# Altium schematic sheet 13 CAN RS232 485.SchDoc
size A4
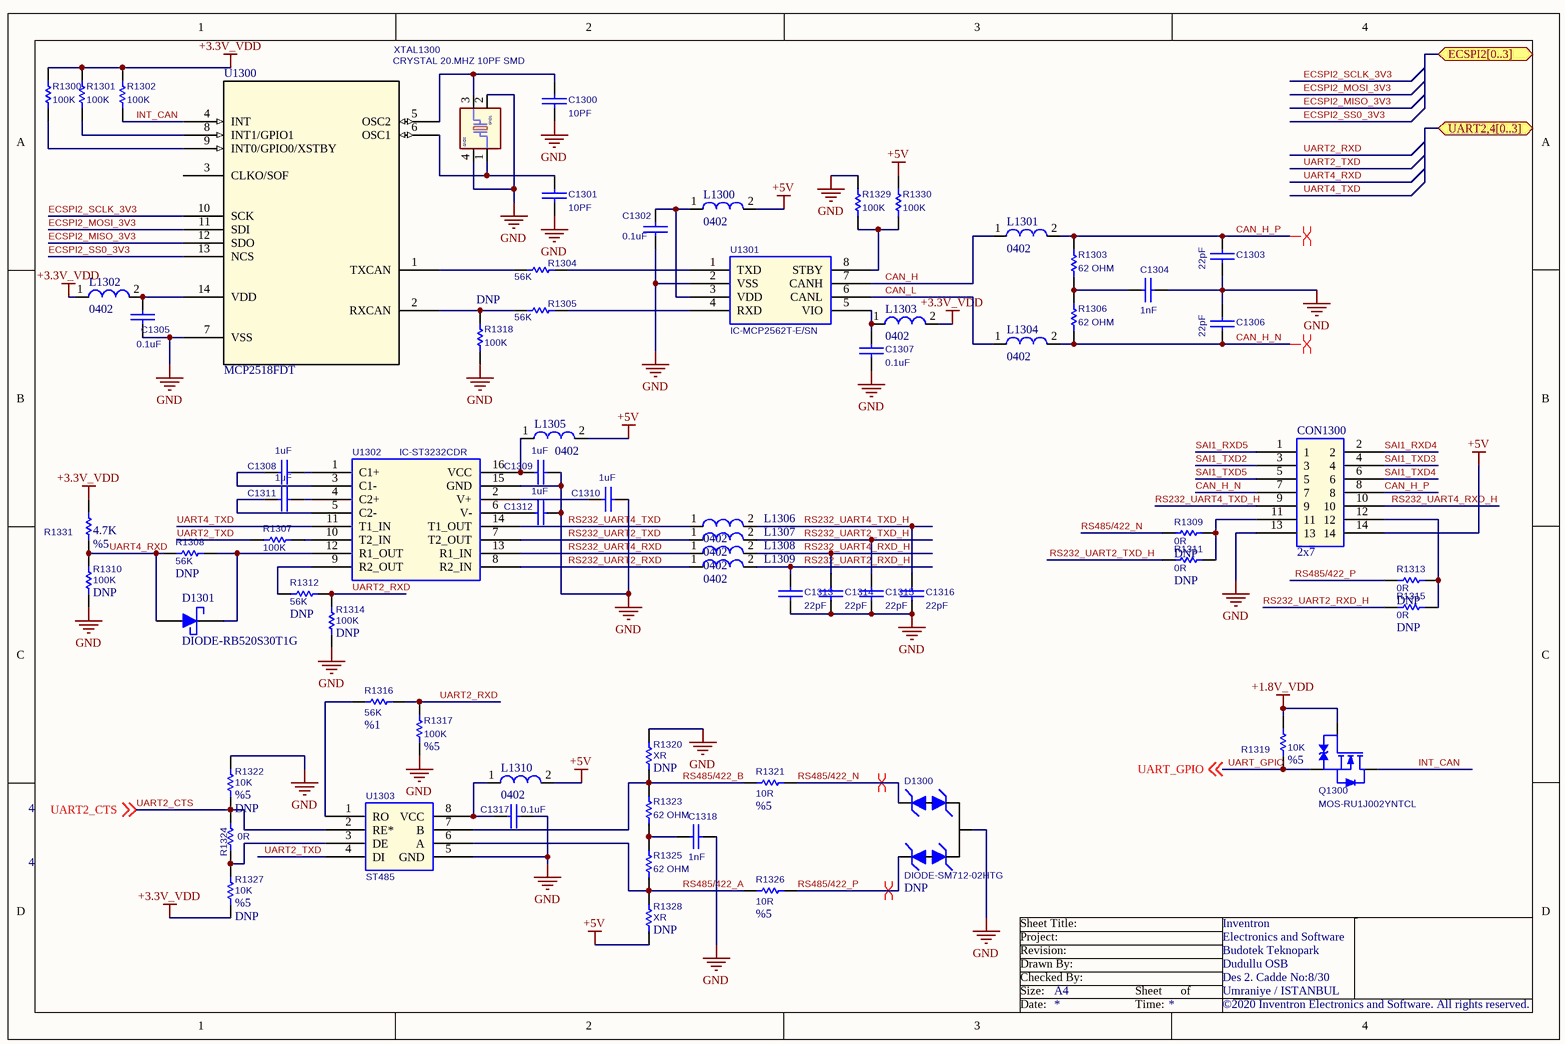
[diagram p0: 13 CAN RS232 485.SchDoc]

## Parts
C1300  10PF  [0402_CC]
C1301  10PF  [0402_CC]
C1302  0.1uF  [0402_CC]
C1303  22pF  [0402_CC]
C1304  1nF  [0603_CC]
C1305  0.1uF  [0402_CC]
C1306  22pF  [0402_CC]
C1307  0.1uF  [0402_CC]
C1308  1uF  [0603_CC]
C1309  1uF  [0603_CC]
C1310  1uF  [0603_CC]
C1311  1uF  [0603_CC]
C1312  1uF  [0603_CC]
C1313  22pF  [0402_CC]
C1314  22pF  [0402_CC]
C1315  22pF  [0402_CC]
C1316  22pF  [0402_CC]
C1317  0.1uF  [0402_CC]
C1318  1nF  [0603_CC]
CON1300  2x7  [HEADER 2.54 2X7]
D1300  DIODE-SM712-02HTG  ASSY_OPT: DNP  [SOT23]  (no BOM)
D1301  DIODE-RB520S30T1G  [SOD523]
L1300  0402  [0402_RES]
L1301  0402  [0402_RES]
L1302  0402  [0402_RES]
L1303  0402  [0402_RES]
L1304  0402  [0402_RES]
L1305  0402  [0402_RES]
L1306  0402  [0402_RES]
L1307  0402  [0402_RES]
L1308  0402  [0402_RES]
L1309  0402  [0402_RES]
L1310  0402  [0402_RES]
Q1300  MOS-RU1J002YNTCL  [SC-85-3/SOT-323FL]
R1300  100K  [0402_RES]
R1301  100K  [0402_RES]
R1302  100K  [0402_RES]
R1303  62 OHM  [1206]
R1304  56K  [0402_RES]
R1305  56K  [0402_RES]
R1306  62 OHM  [1206]
R1307  100K  [0402_RES]
R1308  56K  ASSY_OPT: DNP  [0402_RES]  (no BOM)
R1309  0R  ASSY_OPT: DNP  [0402_RES]  (no BOM)
R1310  100K  ASSY_OPT: DNP  [0402_RES]  (no BOM)
R1311  0R  ASSY_OPT: DNP  [0402_RES]  (no BOM)
R1312  56K  ASSY_OPT: DNP  [0402_RES]  (no BOM)
R1313  0R  ASSY_OPT: DNP  [0402_RES]  (no BOM)
R1314  100K  ASSY_OPT: DNP  [0402_RES]  (no BOM)
R1315  0R  ASSY_OPT: DNP  [0402_RES]  (no BOM)
R1316  56K  Tolerance: %1  [0402_RES]
R1317  100K  Tolerance: %5  [0402_RES]
R1318  100K  ASSY_OPT: DNP  [0402_RES]  (no BOM)
R1319  10K  Tolerance: %5  [0402_RES]
R1320  XR  ASSY_OPT: DNP  [0603_RES]  (no BOM)
R1321  10R  Tolerance: %5  [0402_RES]
R1322  10K  Tolerance: %5  ASSY_OPT: DNP  [0402_RES]  (no BOM)
R1323  62 OHM  [1206]
R1324  0R  [0402_RES]
R1325  62 OHM  [1206]
R1326  10R  Tolerance: %5  [0402_RES]
R1327  10K  Tolerance: %5  ASSY_OPT: DNP  [0402_RES]  (no BOM)
R1328  XR  ASSY_OPT: DNP  [0603_RES]  (no BOM)
R1329  100K  [0402_RES]
R1330  100K  [0402_RES]  (no BOM)
R1331  4.7K  Tolerance: %5  [0402_RES]
U1300  MCP2518FDT  [SOIC-14]
U1301  IC-MCP2562T-E/SN  [8-SOIC/FAN3229]
U1302  IC-ST3232CDR  [SO-16]
U1303  ST485  [8-SOIC/FAN3229]
XTAL1300  CRYSTAL 20.MHZ 10PF SMD  [XTLOSC4_3P2X2P5MM_SM]

## Ports
ECSPI2[0..3] (bidir), UART2,4[0..3] (bidir)

## Nets
+1.8V_VDD: Q1300.1(G) R1319.1
+3.3V_VDD: L1302.1 L1303.2 R1300.2 R1301.2 R1302.2 R1327.1 R1331.2
+5V: CON1300.14 L1300.2 L1305.2 L1310.2 R1328.1 R1330.2
GND: C1300.2 C1301.2 C1302.1 C1303.2 C1304.2 C1305.2 C1306.1 C1307.1 C1309.2 C1310.2 C1312.2 C1313.2 C1314.2 C1315.2 C1316.2 C1317.2 C1318.2 CON1300.13 D1300.3 R1310.1 R1314.1 R1317.2 R1318.1 R1320.1 R1322.2 R1329.2 U1300.7(VSS) U1301.2(VSS) U1302.15(GND) U1303.5(GND) XTAL1300.2(GND1) XTAL1300.4(GND2)
CAN_H: L1301.1 U1301.7(CANH)
CAN_H_N: C1306.2 CON1300.7 L1304.2 R1306.1
CAN_H_P: C1303.1 CON1300.8 L1301.2 R1303.2
CAN_L: L1304.1 U1301.6(CANL)
ECSPI2_MISO_3V3: U1300.12(SDO)
ECSPI2_MOSI_3V3: U1300.11(SDI)
ECSPI2_SCLK_3V3: U1300.10(SCK)
ECSPI2_SS0_3V3: U1300.13(NCS)
INT_CAN: Q1300.3(D) R1302.1 U1300.4(INT)
RS232_UART2_RXD: L1309.1 U1302.8(R2_IN)
RS232_UART2_RXD_H: C1313.1 L1309.2 R1315.1
RS232_UART2_TXD: L1307.1 U1302.7(T2_OUT)
RS232_UART2_TXD_H: C1315.1 L1307.2 R1311.1
RS232_UART4_RXD: L1308.1 U1302.13(R1_IN)
RS232_UART4_RXD_H: C1314.1 CON1300.10 L1308.2
RS232_UART4_TXD: L1306.1 U1302.14(T1_OUT)
RS232_UART4_TXD_H: C1316.1 CON1300.9 L1306.2
RS485/422_A: R1325.1 R1326.1 R1328.2 U1303.6(A)
RS485/422_B: R1320.2 R1321.1 R1323.2 U1303.7(B)
RS485/422_N: D1300.1 R1309.1 R1321.2
RS485/422_P: D1300.2 R1313.1 R1326.2
SAI1_RXD4: CON1300.2
SAI1_RXD5: CON1300.1
SAI1_TXD2: CON1300.3
SAI1_TXD3: CON1300.4
SAI1_TXD4: CON1300.6
SAI1_TXD5: CON1300.5
UART2_CTS: R1322.1 R1324.2 U1303.2(RE*) ; off-sheet UART2_CTS
UART2_RXD: R1312.2 R1314.2 R1316.1 R1317.1
UART2_TXD: R1307.2 U1303.4(DI)
UART4_RXD: D1301.1(A) R1308.1 R1310.2 R1331.1
UART4_TXD: U1302.11(T1_IN)
UART_GPIO: Q1300.2(S) R1319.2 ; off-sheet UART_GPIO
NetC1300_1: C1300.1 U1300.5(OSC2) XTAL1300.3
NetC1301_1: C1301.1 U1300.6(OSC1) XTAL1300.1
NetC1302_2: C1302.2 L1300.1 U1301.3(VDD)
NetC1304_1: C1304.1 R1303.1 R1306.2
NetC1305_1: C1305.1 L1302.2 U1300.14(VDD)
NetC1307_2: C1307.2 L1303.1 U1301.5(VIO)
NetC1308_1: C1308.1 U1302.3(C1-)
NetC1308_2: C1308.2 U1302.1(C1+)
NetC1309_1: C1309.1 L1305.1 U1302.16(VCC)
NetC1310_1: C1310.1 U1302.2(V+)
NetC1311_1: C1311.1 U1302.5(C2-)
NetC1311_2: C1311.2 U1302.4(C2+)
NetC1312_1: C1312.1 U1302.6(V-)
NetC1317_1: C1317.1 L1310.1 U1303.8(VCC)
NetC1318_1: C1318.1 R1323.1 R1325.2
NetCON1300_11: CON1300.11 R1309.2 R1311.2
NetCON1300_12: CON1300.12 R1313.2 R1315.2
NetD1301_2: D1301.2(K) R1308.2 U1302.12(R1_OUT)
NetR1300_1: R1300.1 U1300.9(INT0/GPIO0/XSTBY)
NetR1301_1: R1301.1 U1300.8(INT1/GPIO1)
NetR1304_1: R1304.1 U1300.1(TXCAN)
NetR1304_2: R1304.2 U1301.1(TXD)
NetR1305_1: R1305.1 R1318.2 U1300.2(RXCAN)
NetR1305_2: R1305.2 U1301.4(RXD)
NetR1307_1: R1307.1 U1302.10(T2_IN)
NetR1312_1: R1312.1 U1302.9(R2_OUT)
NetR1316_2: R1316.2 U1303.1(RO)
NetR1324_1: R1324.1 R1327.2 U1303.3(DE)
NetR1329_1: R1329.1 R1330.1 U1301.8(STBY)

Not connected (* = marked no-connect by the designer): U1300 3(CLKO/SOF)

## Layout directives
differential pair; differential pair class 120 OHM: CAN_H_N, CAN_H_P, RS485/422_N, RS485/422_P

## Notes on the sheet
- 4
- Sheet Title:
- Inventron
- Size:
- Drawn By:
- Revision:
- Project:
- Checked By:
- A4
- Sheet
- of
- Budotek Teknopark
- Dudullu OSB
- Des 2. Cadde No:8/30
- Umraniye / ISTANBUL
- Electronics and Software
- Date:
- Time:
- ©2020 Inventron Electronics and Software. All rights reserved.

## Library data of the parts
C1300 C1301 = CAP-CC0402JRNPO9BN100: CAP CER 10PF 50V C0G/NPO 0402; Manufacturer-1: Yageo; Class: Capacitor; Manufacturer Part Number-1: CC0402JRNPO9BN100; Footprint: *; Manufacturer-2: *; Manufacturer Part Number-2: *; Inventron Stock No: *; Created By: *; Created Date: *; Checked By: *; ASSY_OPT: *; Dimensions: *; Unit Price: *; Revision Date/Note: *; Price Break: *; Opt. Temp.: *; Features: *
C1302 C1305 C1307 = CAP-CL05B104KO5NNNC: CAP VER 0.1UF 16V X7R 0402; Manufacturer-1: SAMSUNG; Opt. Temp.: -55/+125; Class: Capacitor; Manufacturer Part Number-1: CL05B104KO5NNNC; Footprint: 0402; Manufacturer-2: *; Manufacturer Part Number-2: *; Inventron Stock No: *; Created By: LA; Created Date: 23.11.2018; Checked By: *; ASSY_OPT: *; Dimensions: *; Unit Price: 0,00499; Revision Date/Note: *; Price Break: 10K
C1303 C1306 C1313-C1316 = CAP-C0402C220K5GACTU: CAP CER 22PF 50V C0G/NPO 0402; Manufacturer-1: KEMET; Opt. Temp.: -55/+125; Class: Capacitor; Manufacturer Part Number-1: C0402C220K5GACTU; Footprint: 0402; Manufacturer-2: *; Manufacturer Part Number-2: *; Inventron Stock No: *; Created By: LA; Created Date: 23.11.2018; Checked By: *; ASSY_OPT: *; Dimensions: *; Unit Price: 0,00420; Revision Date/Note: *; Price Break: 10K
C1304 C1318 = CAP-CGA3E2X7R2A102M080AA: CAP CER 1000PF 100V X7R 0603; Manufacturer-1: TDK; Opt. Temp.: -55/+125; Class: Capacitor; Manufacturer Part Number-1: CGA3E2X7R2A102M080AA; Footprint: 0603; Manufacturer-2: *; Manufacturer Part Number-2: *; Inventron Stock No: *; Created By: LA; Checked By: *; ASSY_OPT: *; Dimensions: *; Revision Date/Note: *; Features: AUTOMOTIVE
C1308-C1312 = CAP-CL10B105KA8NNNC: CAP CER 1UF 25V X7R 0603; Manufacturer-1: SAMSUNG; Class: Capacitor; Manufacturer Part Number-1: CL10B105KA8NNNC; Footprint: *; Manufacturer-2: *; Manufacturer Part Number-2: *; Inventron Stock No: *; Created By: LA; Created Date: *; Checked By: *; ASSY_OPT: *; Dimensions: *; Unit Price: *; Revision Date/Note: *; Price Break: *; Opt. Temp.: *; Features: *
C1317 = CAP-CL05B104KO5NNNC: CAP VER 0.1UF 16V X7R 0402; Manufacturer-1: SAMSUNG; Opt. Temp.: -55/+125; Class: Capacitor; ASSY_OPT: DNP; Manufacturer Part Number-1: CL05B104KO5NNNC; Footprint: 0402; Manufacturer-2: *; Manufacturer Part Number-2: *; Inventron Stock No: *; Created By: LA; Created Date: 23.11.2018; Checked By: *; Dimensions: *; Unit Price: 0,00499; Revision Date/Note: *; Price Break: 10K
CON1300 = CON-14 PIN 2.54MM: 14 PIN 2.54MM HEADER; Class: Connector; Manufacturer Part Number-1: *; Footprint: *; Manufacturer-1: *; Manufacturer-2: *; Manufacturer Part Number-2: *; Inventron Stock No: *; Created By: *; Created Date: *; Checked By: *; ASSY_OPT: *; Dimensions: *; Unit Price: *; Revision Date/Note: *; Price Break: *; Opt. Temp.: *
D1300 = DIODE-SM712-02HTG: TVS DIODE 12V 31V SOT23-3; Manufacturer-1: LITTELFUSE; Opt. Temp.: -40/+125; Manufacturer Part Number-1: SM712-02HTG; Footprint: *; Manufacturer-2: *; Manufacturer Part Number-2: *; Inventron Stock No: *; Created By: LA; Created Date: 06.05.2019; Checked By: *; Dimensions: *; Unit Price: 0,30450; Revision Date/Note: *; Price Break: 3K; Class: Diode
D1301 = DIODE-RB520S30T1G: DIODE SCHOTTKY 30V 200MA SOD523; Manufacturer-1: ON SEMI; Opt. Temp.: -55/+150; Manufacturer Part Number-1: RB520S30T1G; Footprint: SOD-523; Manufacturer-2: *; Manufacturer Part Number-2: *; Inventron Stock No: *; Created By: LA; Created Date: 23.11.2018; Checked By: *; ASSY_OPT: *; Dimensions: *; Unit Price: 0,0324; Revision Date/Note: *; Price Break: 3K; Class: Diode
L1300-L1310 = IND-FERRITE (RES 0 OHM) 0402: 0OHM 0402; Manufacturer Part Number-1: RMCF0402ZT0R00; Manufacturer-1: Stackpole Electronics Inc; Class: Inductor; Footprint: 0402; Manufacturer-2: *; Inventron Stock No: *; Created By: EE; Checked By: *; ASSY_OPT: *; Dimensions: *; Unit Price: 0.00186; Revision Date/Note: *; Price Break: 1000
Q1300 = MOS-RU1J002YNTCL: MOSFET N-CH 50V 0.2A UMT3F; Manufacturer-1: ROHM; Opt. Temp.: -55/+150; Class: Transistor; Manufacturer Part Number-1: RU1J002YNTCL; Footprint: SC-85; Manufacturer-2: *; Manufacturer Part Number-2: *; Inventron Stock No: *; Created By: LA; Created Date: 23.11.2018; Checked By: *; ASSY_OPT: *; Dimensions: *; Unit Price: 0,0384; Revision Date/Note: *; Price Break: 3K
R1300-R1302 R1307 R1310 R1314 R1318 R1329 = RES-RMCF0402JT100K: RES 100K OHM 5% 1/16W 0402; Manufacturer-1: STACKPOLE; Opt. Temp.: -55/+155; Class: Resistor; Tolerance: %5; Manufacturer Part Number-1: RMCF0402JT100K; Footprint: 0402; Manufacturer-2: *; Manufacturer Part Number-2: *; Inventron Stock No: *; Created By: LA; Created Date: 23.11.2018; Checked By: *; Dimensions: *; Unit Price: 0,00127; Revision Date/Note: *; Price Break: 10K
  R1300-R1302 R1307 R1329: ASSY_OPT: *
R1303 R1306 R1323 R1325 = RES-RMCF1206JT62R0: 62 Ohms ±5% 0.25W, 1/4W Chip Resistor 1206 (3216 Metric) Automotive AEC-Q200 Thick Film; Manufacturer-1: Stackpole Electronics Inc; Manufacturer Part Number-1: RMCF1206JT62R0; Manufacturer-2: *; Manufacturer Part Number-2: *; Inventron Stock No: *; Created By: EE; Created Date: *; Checked By: *; ASSY_OPT: *; Dimensions: *; Unit Price: 0.00323; Revision Date/Note: *; Price Break: 5000; Opt. Temp.: *; Class: Resistor; Tolerance: *
R1304 R1305 R1308 R1312 = RES-56K: RES 56K OHM 1% 1/16W 0402; Opt. Temp.: -55/+155; Class: Resistor; Tolerance: %1; Footprint: 0402; Manufacturer-2: *; Manufacturer Part Number-2: *; Inventron Stock No: *; Created By: LA; Checked By: *; Dimensions: *; Revision Date/Note: *
  R1304 R1305: ASSY_OPT: *
R1309 R1311 R1313 R1315 = RES-RMCF0402ZT0R00: RES 0 OHM JUMPER 1/16W 0402; Manufacturer-1: STACKPOLE; Opt. Temp.: -55/+155; Class: Resistor; Manufacturer Part Number-1: RMCF0402ZT0R00; Footprint: 0402; Manufacturer-2: *; Manufacturer Part Number-2: *; Inventron Stock No: *; Created By: LA; Created Date: 23.11.2018; Checked By: *; Dimensions: *; Unit Price: 0,00127; Revision Date/Note: *; Price Break: 10K
R1316 = RES-56K: RES 56K OHM 1% 1/16W 0402; Opt. Temp.: -55/+155; Class: Resistor; Footprint: 0402; Manufacturer-2: *; Manufacturer Part Number-2: *; Inventron Stock No: *; Created By: LA; Checked By: *; ASSY_OPT: *; Dimensions: *; Revision Date/Note: *
R1317 = RES-RMCF0402JT100K: RES 100K OHM 5% 1/16W 0402; Manufacturer-1: STACKPOLE; Opt. Temp.: -55/+155; Class: Resistor; Manufacturer Part Number-1: RMCF0402JT100K; Footprint: 0402; Manufacturer-2: *; Manufacturer Part Number-2: *; Inventron Stock No: *; Created By: LA; Created Date: 23.11.2018; Checked By: *; ASSY_OPT: *; Dimensions: *; Unit Price: 0,00127; Revision Date/Note: *; Price Break: 10K
R1319 R1322 R1327 = RES-RMCF0402JT10K0: RES 10K OHM 5% 1/16W 0402; Manufacturer-1: STACKPOLE; Opt. Temp.: -55/+155; Class: Resistor; Manufacturer Part Number-1: RMCF0402JT10K0; Footprint: 0402; Manufacturer-2: *; Manufacturer Part Number-2: *; Inventron Stock No: *; Created By: LA; Created Date: 23.11.2018; Checked By: *; Dimensions: *; Unit Price: 0,00127; Revision Date/Note: *; Price Break: 10K
  R1319: ASSY_OPT: *
R1320 R1328 = RES-0R 0603: RES; Class: Resistor; Manufacturer-2: *; Manufacturer Part Number-2: *; Inventron Stock No: *; Created By: LA; Created Date: 23.11.2018; Checked By: *; Dimensions: *; Revision Date/Note: *
R1321 R1326 = RES-RMCF0402JT10R0: RES 10 OHM 5% 1/16W 0402; Manufacturer-1: STACKPOLE; Opt. Temp.: -55/+155; Class: Resistor; Manufacturer Part Number-1: RMCF0402JT10R0; Footprint: 0402; Manufacturer-2: *; Manufacturer Part Number-2: *; Inventron Stock No: *; Created By: LA; Created Date: 23.11.2018; Checked By: *; ASSY_OPT: *; Dimensions: *; Unit Price: 0,00127; Revision Date/Note: *; Price Break: 10K
R1324 = RES-RMCF0402ZT0R00: RES 0 OHM JUMPER 1/16W 0402; Manufacturer-1: STACKPOLE; ASSY_OPT: DNP; Opt. Temp.: -55/+155; Class: Resistor; Manufacturer Part Number-1: RMCF0402ZT0R00; Footprint: 0402; Manufacturer-2: *; Manufacturer Part Number-2: *; Inventron Stock No: *; Created By: LA; Created Date: 23.11.2018; Checked By: *; Dimensions: *; Unit Price: 0,00127; Revision Date/Note: *; Price Break: 10K
R1330 = RES-RMCF0402JT100K: RES 100K OHM 5% 1/16W 0402; Manufacturer-1: STACKPOLE; ASSY_OPT: DNP; Opt. Temp.: -55/+155; Class: Resistor; Tolerance: %5; Manufacturer Part Number-1: RMCF0402JT100K; Footprint: 0402; Manufacturer-2: *; Manufacturer Part Number-2: *; Inventron Stock No: *; Created By: LA; Created Date: 23.11.2018; Checked By: *; Dimensions: *; Unit Price: 0,00127; Revision Date/Note: *; Price Break: 10K
R1331 = RES-4.7K: RES 4.7K OHM 5% 1/16W 0402; Manufacturer Part Number-1: RC0402JR-074K7L; Manufacturer-1: Yageo; Opt. Temp.: -55/+155; Class: Resistor; Footprint: 0402; Manufacturer-2: *; Manufacturer Part Number-2: *; Inventron Stock No: *; Created By: LA; Checked By: *; ASSY_OPT: *; Dimensions: *; Revision Date/Note: *
U1300 = IC-MCP2518FDT-E/SL: CAN Controller CAN 2.0 SPI Interface 14-SOIC; Manufacturer-1: Microchip Technology; Opt. Temp.: -40°C ~ 125°C; Class: ICs; Manufacturer Part Number-1: MCP2518FDT-E/SL; Footprint: 14SOIC; Manufacturer-2: *; Manufacturer Part Number-2: *; Inventron Stock No: *; Created By: EE; Created Date: *; Checked By: *; ASSY_OPT: *; Dimensions: *; Unit Price: 1.21; Revision Date/Note: *; Price Break: 6000
U1301 = IC-MCP2562T-E/SN: IC TXRX CAN 8SOIC; Manufacturer-1: MICROCHIP; Opt. Temp.: -40/+125; Class: ICs; Manufacturer Part Number-1: MCP2562T-E/SN; Footprint: *; Manufacturer-2: *; Manufacturer Part Number-2: *; Inventron Stock No: *; Created By: LA; Created Date: 29.03.2019; Checked By: *; ASSY_OPT: *; Dimensions: *; Unit Price: 0,7; Revision Date/Note: *; Price Break: 100
U1302 = IC-ST3232CDR: IC TX/RX 3-3.5V RS232 LP 16-SOIC; Manufacturer-1: STM; Opt. Temp.: 0/+70; Class: ICs; Manufacturer Part Number-1: ST3232CDR; Footprint: *; Manufacturer-2: *; Manufacturer Part Number-2: *; Inventron Stock No: *; Created By: LA; Created Date: 29.03.2019; Checked By: *; ASSY_OPT: *; Dimensions: *; Unit Price: 0,52; Revision Date/Note: *; Price Break: 1K
U1303 = IC-ST485EBDR: IC TXRX LOPWR RS485/422 8 SOIC; Manufacturer Part Number-1: STM; Opt. Temp.: -40/+85; Class: ICs; Footprint: *; Manufacturer-1: ST485EBDR; Manufacturer-2: *; Manufacturer Part Number-2: *; Inventron Stock No: *; Created By: LA; Created Date: 19.04.2018; Checked By: *; ASSY_OPT: *; Dimensions: *; Unit Price: 0,52854; Revision Date/Note: *; Price Break: 1K
XTAL1300 = XTAL-FA-238 20.0000MB-K0: CRYSTAL 20.0000MHZ 10PF SMD; Manufacturer-1: EPSON; Opt. Temp.: -20°C ~ 70°C; Manufacturer Part Number-1: FA-238 20.0000MB-K0; Footprint: 4-SMD; Manufacturer-2: *; Manufacturer Part Number-2: *; Inventron Stock No: *; Created By: E.E; Created Date: 20.10.2020; Checked By: *; ASSY_OPT: *; Dimensions: *; Unit Price: 0.17; Revision Date/Note: *; Price Break: 1K; Class: Crystal